# Altium schematic sheet connect.SchDoc: Bison-Board
size A4; DrawnBy: mzy2364; Revision: V1.4
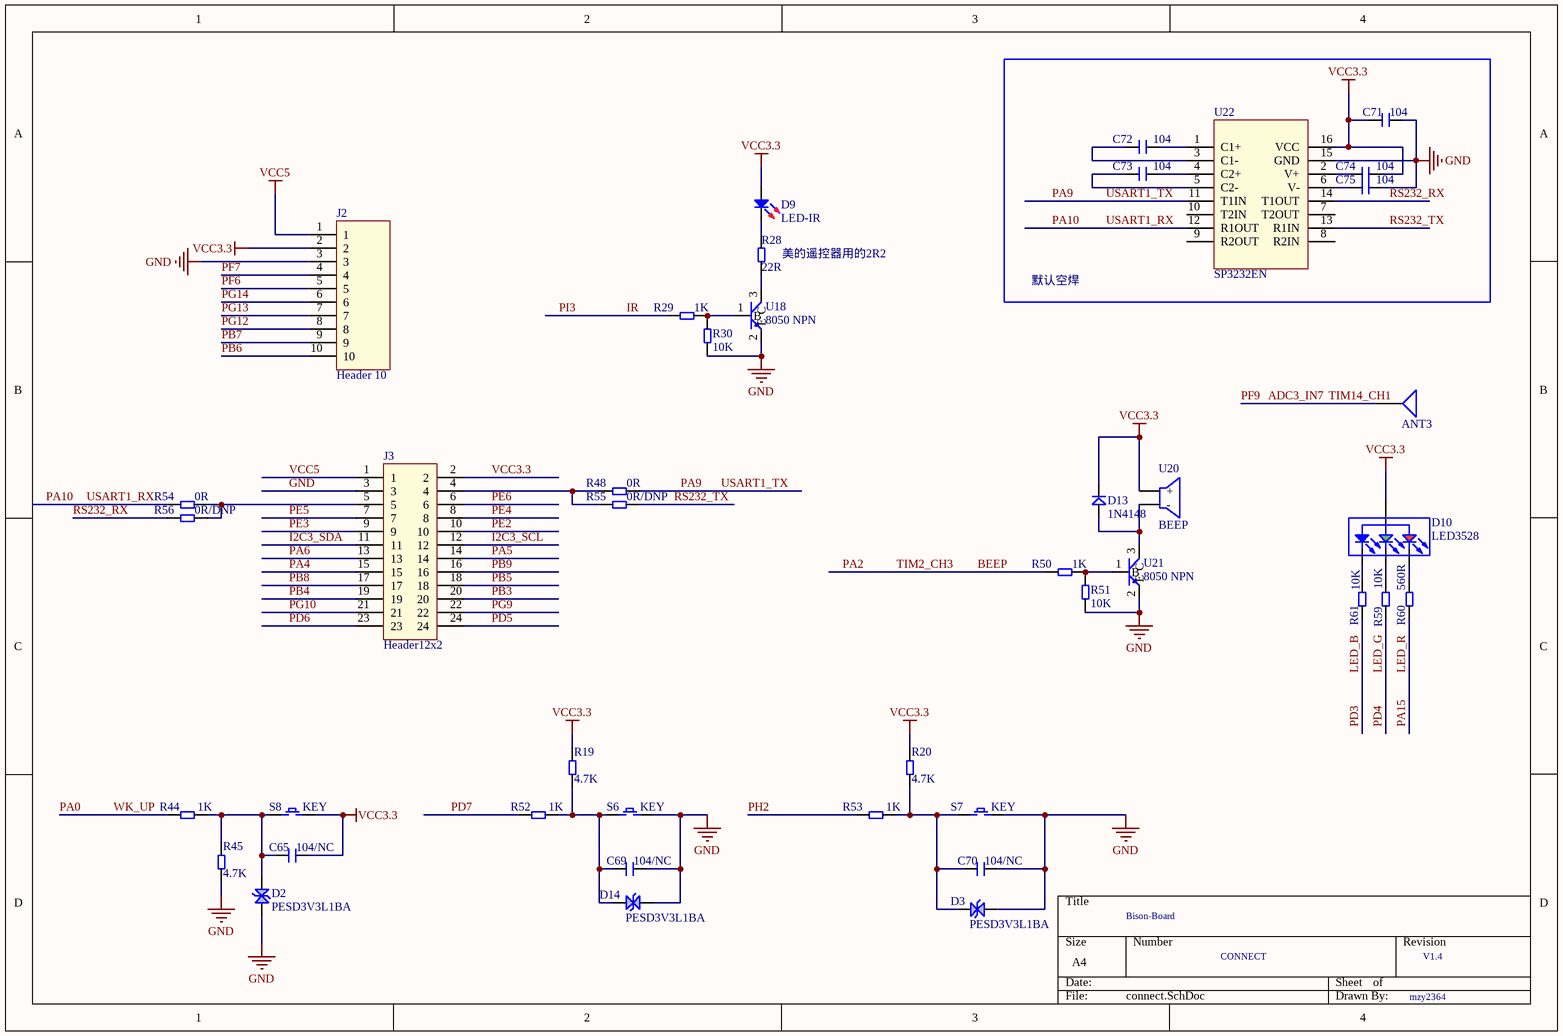
[diagram p0: connect.SchDoc]

## Parts
ANT3  ANT  [ANT IPEX]  (value not drawn)
C65  104/NC  [C 0603]
C69  104/NC  [C 0603]
C70  104/NC  [C 0603]
C71  104  [C 0603]
C72  104  [C 0603]
C73  104  [C 0603]
C74  104  [C 0603]
C75  104  [C 0603]
D2  PESD3V3L1BA  [SOD323]
D3  PESD3V3L1BA  [SOD323]
D9  LED-IR  [IR12-21C]
D10  LED3528  [LED3528-4PIN]
D13  1N4148  [SOD123]
D14  PESD3V3L1BA  [SOD323]
J2  Header 10  [HEADER 10]
J3  Header12x2  [HDR2.54-M-LS-2x12P]
R19  4.7K  [R 0603]
R20  4.7K  [R 0603]
R28  22R  [R 0603]
R29  1K  [R 0603]
R30  10K  [R 0603]
R44  1K  [R 0603]
R45  4.7K  [R 0603]
R48  0R  [R 0603]
R50  1K  [R 0603]
R51  10K  [R 0603]
R52  1K  [R 0603]
R53  1K  [R 0603]
R54  0R  [R 0603]
R55  0R/DNP  [R 0603]
R56  0R/DNP  [R 0603]
R59  10K  [R 0603]
R60  560R  [R 0603]
R61  10K  [R 0603]
S6  KEY  [KEY TSW SMD-6*6*6]
S7  KEY  [KEY TSW SMD-6*6*6]
S8  KEY  [KEY TSW SMD-6*6*6]
U18  8050 NPN  [SOT23-3]
U20  BEEP  [MLT-5020]
U21  8050 NPN  [SOT23-3]
U22  SP3232EN  [TSSOP16]

## Blocks framed on the sheet
默认空焊: C71-C75 U22

## Nets
GND: C69.2 C70.2 C71.1 C75.2 D2.1 D3.2 D14.2 J2.3 J3.3 R30.2 R45.1 R51.2 S6.2 S7.2 U18.2(E) U21.2(E) U22.15(GND)
VCC3.3: C65.2 C71.2 C74.2 D9.1(A) D10.2(+) D13.2 J2.2 J3.2 R19.2 R20.2 S8.2 U20.1(+) U22.16(VCC)
VCC5: J2.1 J3.1
ADC3_IN7: ANT3.1  [also labelled PF9, TIM14_CH1]
BEEP: R50.2  [also labelled PA2, TIM2_CH3]
I2C3_SCL: J3.12
I2C3_SDA: J3.11
IR: R29.2  [also labelled PI3]
LED_B: R61.1  [also labelled PD3]
LED_G: R59.1  [also labelled PD4]
LED_R: R60.1  [also labelled PA15]
PA0: R44.1  [also labelled WK_UP]
PA4: J3.15
PA5: J3.14
PA6: J3.13
PA9: R48.1 U22.11(T1IN)  [also labelled USART1_TX]
PA10: R54.2 U22.12(R1OUT)  [also labelled USART1_RX]
PB3: J3.20
PB4: J3.19
PB5: J3.18
PB6: J2.10
PB7: J2.9
PB8: J3.17
PB9: J3.16
PD5: J3.24
PD6: J3.23
PD7: R52.1
PE2: J3.10
PE3: J3.9
PE4: J3.8
PE5: J3.7
PE6: J3.6
PF6: J2.5
PF7: J2.4
PG9: J3.22
PG10: J3.21
PG12: J2.8
PG13: J2.7
PG14: J2.6
PH2: R53.1
RS232_RX: R56.2 U22.14(T1OUT)
RS232_TX: R55.1 U22.13(R1IN)
NetC65_1: C65.1 D2.2 R44.2 R45.2 S8.1
NetC69_1: C69.1 D14.1 R19.1 R52.2 S6.1
NetC70_1: C70.1 D3.1 R20.1 R53.2 S7.1
NetC72_1: C72.1 U22.3(C1-)
NetC72_2: C72.2 U22.1(C1+)
NetC73_1: C73.1 U22.5(C2-)
NetC73_2: C73.2 U22.4(C2+)
NetC74_1: C74.1 U22.2(V+)
NetC75_1: C75.1 U22.6(V-)
NetD9_2: D9.2(K) R28.2
NetD10_1: D10.1(R) R60.2
NetD10_3: D10.3(B) R61.2
NetD10_4: D10.4(G) R59.2
NetD13_1: D13.1 U20.2(-) U21.3(C)
NetJ3_4: J3.4 R48.2 R55.2
NetJ3_5: J3.5 R54.1 R56.1
NetR28_1: R28.1 U18.3(C)
NetR29_1: R29.1 R30.1 U18.1(B)
NetR50_1: R50.1 R51.1 U21.1(B)

Not connected (* = marked no-connect by the designer): U22 7(T2OUT) 8(R2IN) 9(R2OUT) 10(T2IN)

## Notes on the sheet
- (near R28) 美的遥控器用的2R2
- CONNECT

## Library data of the parts
C65 C69-C75 = CAP
D2 D3 D14 = D Schottky1: 双向TVS
D13 = Diode
R19 R20 R28-R30 R44 R45 R48 R50-R56 R59-R61 = RES
U18 U21 = NPN